# EAGLE design power distribution (EAGLE 7.6.0)
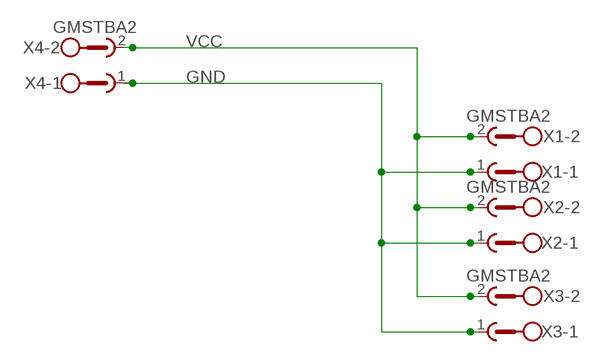
[diagram p0: schematic, sheet 1]

## Parts
X1  GMSTBA2  [GMSTBA2]
X2  GMSTBA2  [GMSTBA2]
X3  GMSTBA2  [GMSTBA2]
X4  GMSTBA2  [GMSTBA2]

## Nets
GND: X1.1 X2.1 X3.1 X4.1
VCC: X1.2 X2.2 X3.2 X4.2

## Library data of the parts
X1-X4 = con-phoenix-762:GMSTBA2: PHOENIX; MF: FARNELL; MPN: 1757242; OC_FARNELL: 3705171; OC_NEWARK: 71C4161

## Net classes
0 default: width 1.27 mm, drill 0.254 mm, clearance 0.889 mm

## Board
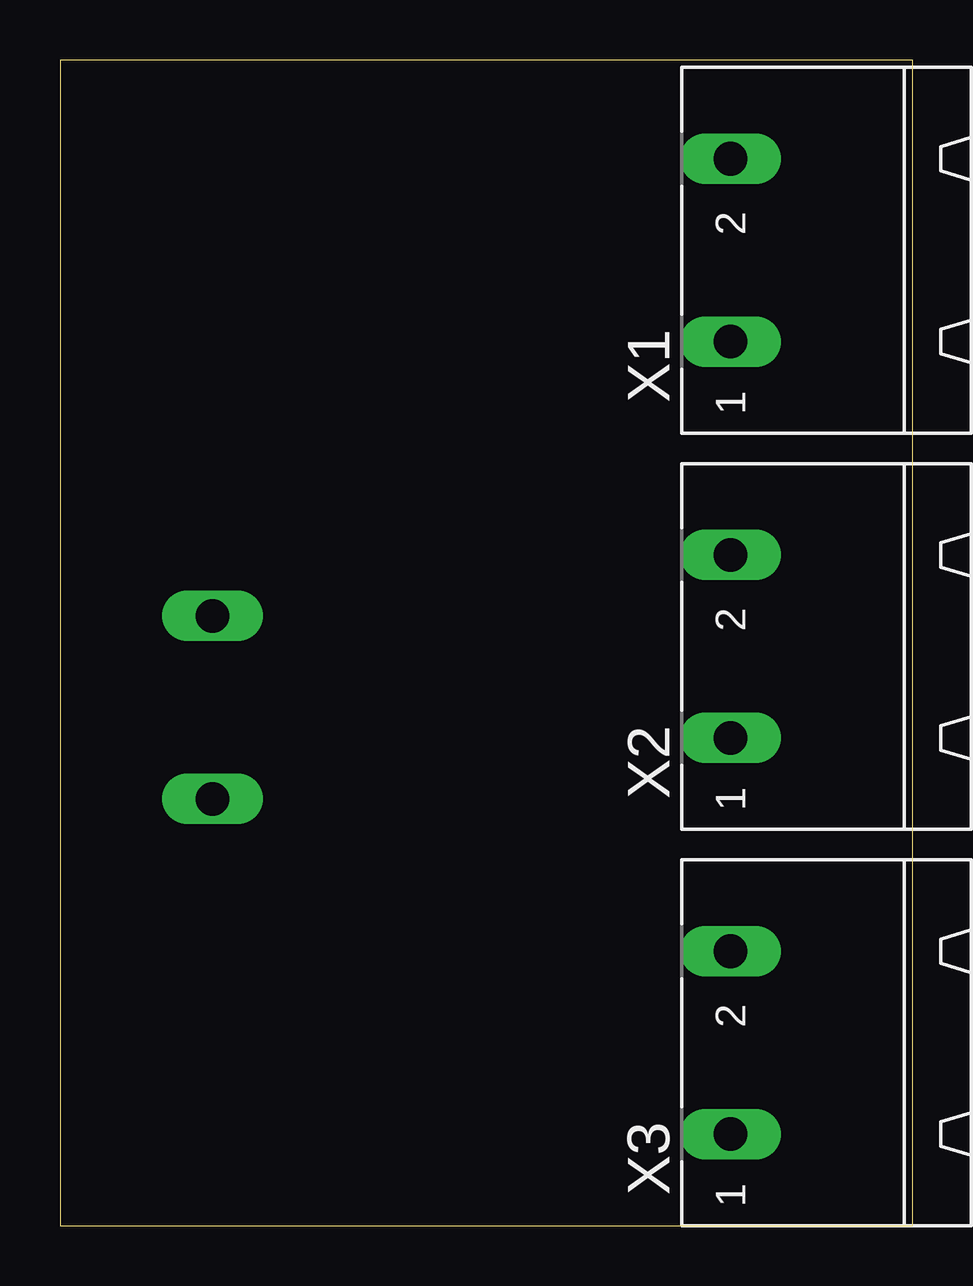
[diagram p1: board, top side]
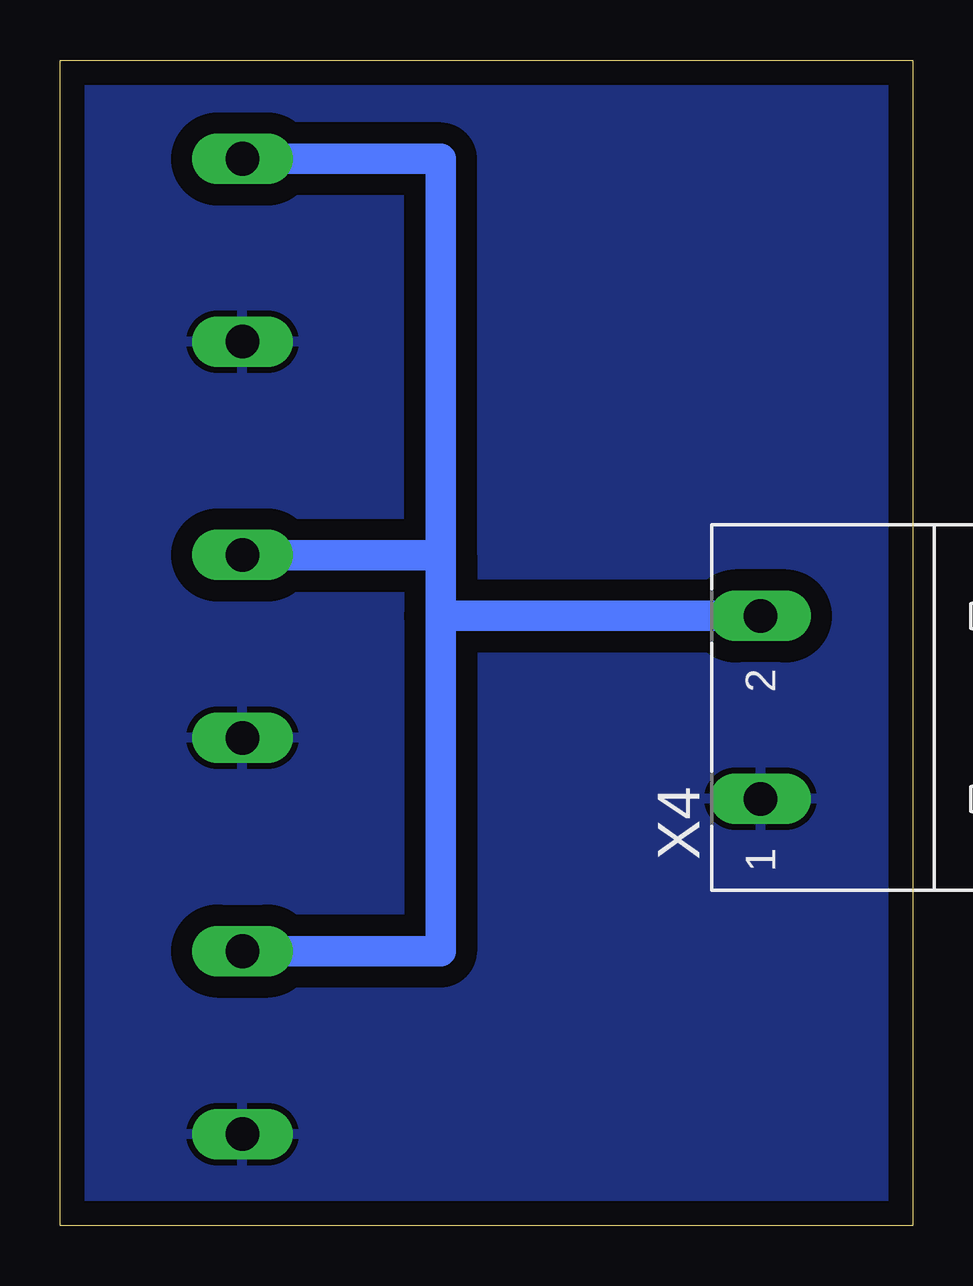
[diagram p2: board, bottom side, seen from below]

Size 35.54 x 48.56 mm. Coordinates in mm from the lower left corner, seen from the top.
Outline: 0,0 35.54,0 35.54,48.56 0,48.56 0,0
Copper layers (1*16): Top 0.035mm / dielectric 1.5mm / Bottom 0.035mm
Design rules "default": minimum track width 10mil, minimum drill 24mil, track to track 8mil, track to pad 8mil, pad to pad 8mil, via to via 8mil, smd to smd 8mil, copper to edge 40mil, drill to drill 8mil, minimum pad ring 10mil, minimum via ring 8mil, stop-mask expansion 4mil, vias tented up to drill 0mil, thermal gap 10mil

### Footprints (pad centres in the part's own frame; a part is rotated, then mirrored left to right if it is on the bottom)
GMSTBA2 = drill 1.397 long: 1 -3.81,5.08; 2 3.81,5.08

### Placement (x,y rotation side)
X1  33.02,40.64 90 top
X2  33.02,24.13 90 top
X3  33.02,7.62 90 top
X4  1.27,21.59 90 bottom

### Tracks (layer width: path | path; a pad name or v marks a point on that pad's centre or on a via)
GND
  pour Bottom: 0,-1.78 35.56,-1.78 35.56,48.26 0,48.26
VCC
  Bottom 1.27: X3.2 19.69,11.43 19.69,25.4 | 19.69,27.94 19.69,25.4 | 19.69,27.94 19.69,44.45 X1.2 | X2.2 19.69,27.94 | 19.69,25.4 X4.2